# Altium schematic sheet LNA.SchDoc
size A4; SheetNumber: 9; SheetTotal: 18
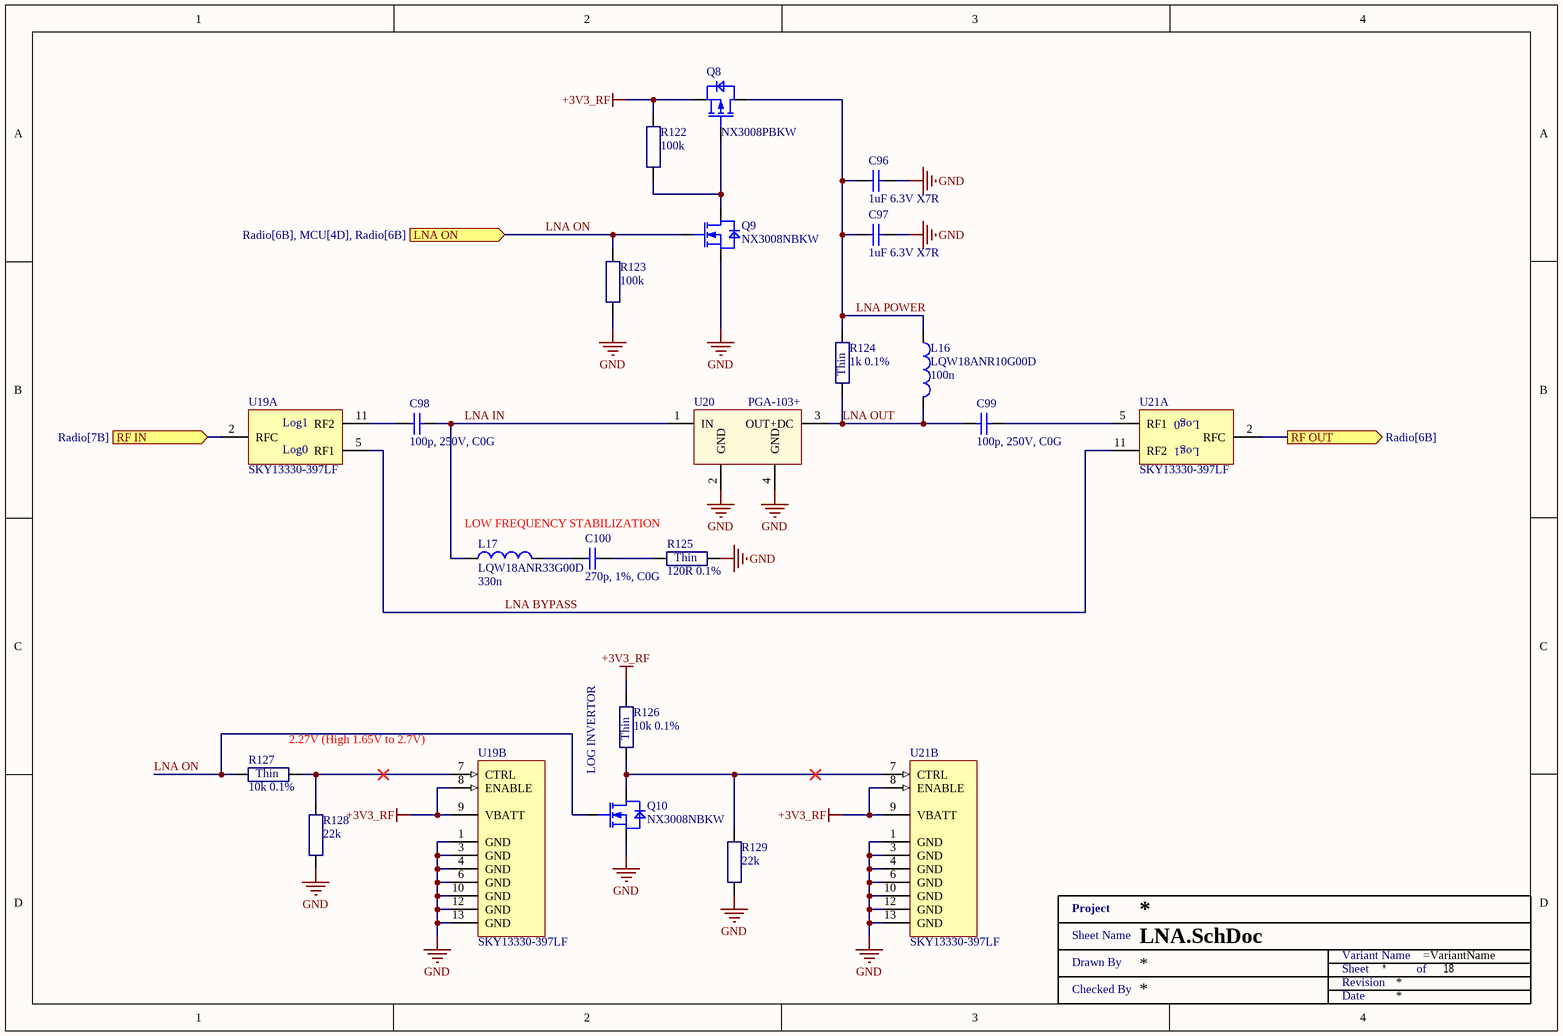
[diagram p0: LNA.SchDoc]

## Parts
C96  1uF 6.3V X7R  [SMD0402]
C97  1uF 6.3V X7R  [SMD0402]
C98  100p, 250V, C0G  [SMD0603]
C99  100p, 250V, C0G  [SMD0603]
C100  270p, 1%, C0G  [SMD0603]
L16  LQW18ANR10G00D  Inductance: 100n  [SMD0603 - L]
L17  LQW18ANR33G00D  Inductance: 330n  [SMD0603 - L]
Q8  NX3008PBKW  [SOT323]
Q9  NX3008NBKW  [SOT323]
Q10  NX3008NBKW  [SOT323]
R122  100k  [SMD0402 - R]
R123  100k  [SMD0402 - R]
R124  1k 0.1%  [SMD0402 - R]
R125  120R 0.1%  [SMD0402 - R]
R126  10k 0.1%  [SMD0402 - R]
R127  10k 0.1%  [SMD0402 - R]
R128  22k  [SMD0402 - R]
R129  22k  [SMD0402 - R]
U19  SKY13330-397LF  [QFN50P200X200X100_HS-13N]  (parts A,B of 2)
U20  PGA-103+  [SOT89]
U21  SKY13330-397LF  [QFN50P200X200X100_HS-13N]  (parts A,B of 2)
XX?  Title 1  (value not drawn)  (graphical)

## Ports
LNA ON (in, see Radio[6B], MCU[4D], Radio[6B]), RF IN (in, see Radio[7B]), RF OUT (out, see Radio[6B])

## Nets
+3V3_RF: Q8.2(S) R122.2 R126.2 U19.8(ENABLE) U19.9(VBATT) U21.8(ENABLE) U21.9(VBATT)
GND: C96.1 C97.1 Q9.2(S) Q10.2(S) R123.1 R125.2 R128.1 R129.1 U19.1(GND) U19.3(GND) U19.4(GND) U19.6(GND) U19.10(GND) U19.12(GND) U19.13(GND) U20.2(GND) U20.4(GND) U21.1(GND) U21.3(GND) U21.4(GND) U21.6(GND) U21.10(GND) U21.12(GND) U21.13(GND)
LNA BYPASS: U19.5(RF1) U21.11(RF2)
LNA IN: C98.2 L17.1 U20.1(IN)
LNA ON: Q9.1(G) Q10.1(G) R123.2 R127.1 ; port LNA ON
LNA OUT: C99.1 L16.2 R124.1 U20.3(OUT+DC)
LNA POWER: C96.2 C97.2 L16.1 Q8.3(D) R124.2
RF IN: U19.2(RFC) ; port RF IN
RF OUT: U21.2(RFC) ; port RF OUT
NetC98_1: C98.1 U19.11(RF2)
NetC99_2: C99.2 U21.5(RF1)
NetC100_1: C100.1 L17.2
NetC100_2: C100.2 R125.1
NetQ8_1: Q8.1(G) Q9.3(D) R122.1
NetQ10_3: Q10.3(D) R126.1 R129.2 U21.7(CTRL)
NetR127_2: R127.2 R128.2 U19.7(CTRL)

## Notes on the sheet
- LOW FREQUENCY STABILIZATION
- 2.27V (High 1.65V to 2.7V)
- LOG INVERTOR
- (in symbol RT0402BRE07120RL) Thin
- (in symbol SKY13330-397LF, part A) Log1; Log0
- (in symbol TC0225B1001TCC) Thin
- (in symbol TC0225B1002TCC) Thin
- (in symbol Title 1) Project; Sheet Name; Variant Name; Drawn By; Sheet; of; Revision; Checked By; Date

## Library data of the parts
C96 C97 = TCC0402X7R105K6R3AT: Capacitor: MLCC; SMD; 0402; 1µF; 6.3V; ±10%; X7R; CCTC; Capacitance: 1u; Supplier 1: LCSC; Supplier Part Number 1: C5448871; Manufacturer: CCTC; Manufacturer Part Number: TCC0402X7R105K6R3AT; Category: Ceramic Capacitors; Stock 1: 242350; Pricing 1: 50=0.0089, 500=0.0072, 1500=0.0063, 10000=0.0058, 20000=0.0053, 50000=0.005 (USD); ComponentLink1URL: https://datasheet.octopart.com:443/TCC0402X7R105K6R3AT-CCTC-datasheet-194166649.pdf?src-supplier=LCSC; ComponentLink1Description: https://datasheet.octopart.com:443/TCC0402X7R105K6R3AT-CCTC-datasheet-194166649.pdf?src-supplier=LCSC; ComponentLink2URL: https://datasheet.octopart.com:443/TCC0402X7R105K6R3AT-CCTC-datasheet-192317456.pdf?src-supplier=HQonline; ComponentLink2Description: https://datasheet.octopart.com:443/TCC0402X7R105K6R3AT-CCTC-datasheet-192317456.pdf?src-supplier=HQonline
C98 C99 = 885342006003: CAP CER 100PF 250V C0G/NP0 0603; Manufacturer: Wurth Electronics Inc.; Tolerance: ±5%; Temperature Coefficient: C0G, NP0; Notification: Current market demand for these product types have resulted in fluctuating and extending lead times. Lead times may differ.; Supplier 1: Digi-Key; Supplier Part Number 1: 732-12167-1-ND; Manufacturer Part Number: 885342006003; RoHS: RoHS Compliant; Category: Capacitors; Stock 1: 43; Pricing 1: 1=0.1, 10=0.043, 100=0.0385, 500=0.03406 (USD); Packaging: Cut Tape (CT); Part Status: Active; Voltage - Rated: 250V; Operating Temperature: -55°C ~ 125°C; Features: -; Ratings: -; Applications: General Purpose; Failure Rate: -; Mounting Type: Surface Mount, MLCC; Package / Case: 0603 (1608 Metric); Size / Dimension: 0.063" L x 0.031" W (1.60mm x 0.80mm); Height - Seated (Max): -; Thickness (Max): 0.034" (0.87mm); Lead Spacing: -; Lead Style: -; ComponentLink1URL: https://katalog.we-online.de/pbs/datasheet/885342006003.pdf; ComponentLink1Description: https://katalog.we-online.de/pbs/datasheet/885342006003.pdf; Supplier 2: Farnell; Supplier Part Number 2: 2812519; Supplier 3: Mouser; Supplier Part Number 3: 710-885342006003; Capacitance: 100p
C100 = GCM1885C2A271FA16D: Cap Ceramic 270pF 100V C0G 1% Pad SMD 0603 125C Automotive T/R; Manufacturer: Murata; Supplier 1: Mouser; Supplier Part Number 1: 81-GCM1885C2A271FA6D; Manufacturer Part Number: GCM1885C2A271FA16D; RoHS: Yes; Category: Ceramic Capacitors; Stock 1: 7715; Pricing 1: 1=0.23000, 10=0.09600, 50=0.09600, 100=0.08100, 1000=0.04900, 10000=0.03800 (USD); Mount: Surface Mount; Case/Package: 0603; Case Code (Imperial): 0603; Case Code (Metric): 1608; Min Operating Temperature: -55°C; Max Operating Temperature: 125°C; Packaging: Cut Tape; Capacitance: 270p; Tolerance: 1%; Voltage Rating: 100V; Ratings: AEC-Q200; RoHS Compliant: Yes; ComponentLink1URL: http://search.murata.co.jp/Ceramy/image/img/A01X/G101/ENG/GCM1885C2A271FA16-01.pdf?src-supplier=Digi-Key; ComponentLink1Description: http://search.murata.co.jp/Ceramy/image/img/A01X/G101/ENG/GCM1885C2A271FA16-01.pdf?src-supplier=Digi-Key; Supplier 2: Farnell; Supplier Part Number 2: 3581578; Supplier 3: Digi-Key; Supplier Part Number 3: 490-16410-1-ND
L16 = LQW18ANR10G00D: Inductor RF Chip Wirewound 100nH 2% 100MHz 34Q-Factor 220mA 680mOhm DCR 0603 Paper T/R; Manufacturer: Murata; Manufacturer Lifecycle Status: IN PRODUCTION; Core Material: Air; Current: 140mA; DC Resistance (DCR): 680mΩ; Number of Circuits: 1; Q Factor: 34; Self Resonant Frequency: 1.8GHz; Shielding: Unshielded; Test Frequency: 150MHz; Supplier 1: Mouser; Supplier Part Number 1: 81-LQW18ANR10G00D; Manufacturer Part Number: LQW18ANR10G00D; RoHS: Compliant; Category: Fixed Inductors; Stock 1: 745; Pricing 1: 1=0.12, 10=0.099, 50=0.099, 100=0.081, 1000=0.067, 10000=0.05 (USD); Case/Package: 0603; Case Code (Imperial): 0603; Case Code (Metric): 1608; Composition: Wirewound; Current Rating: 220mA; DC Current: 220mA; Depth: 1mm; Frequency: 100MHz; Height: 800µm; Height - Seated (Max): 990.6µm; Inductance Tolerance: 2%; Lead Free: Lead Free; Length: 1.6mm; Lifecycle Status: Production; Max Current Rating: 220mA; Max DC Current: 220mA; Max Operating Temperature: 125°C; Military Standard: Not; Min Operating Temperature: -55°C; Mounting Technology: Surface Mount; Pins: 2; Number of Terminals: 2; Packaging: Cut Tape; Radiation Hardening: No; REACH SVHC: Yes; RMS Current (Irms): 220mA; Schedule B: 8504500000, 8504500000|8504500000, 8504500000|8504500000|8504500000, 8504500000|8504500000|8504500000|8504500000; ESR: 680mΩ; Termination: SMD/SMT; Tolerance: 2%; Weight: 3.005049mg; Width: 800µm; ComponentLink1URL: https://datasheet.octopart.com:443/LQW18ANR10G00D-Murata-datasheet-11553032.pdf?src-supplier=element14+APAC; ComponentLink1Description: https://datasheet.octopart.com:443/LQW18ANR10G00D-Murata-datasheet-11553032.pdf?src-supplier=element14+APAC; ComponentLink2URL: https://datasheet.octopart.com:443/LQW18ANR10G00D-Murata-datasheet-518094.pdf?src-supplier=element14+APAC; ComponentLink2Description: https://datasheet.octopart.com:443/LQW18ANR10G00D-Murata-datasheet-518094.pdf?src-supplier=element14+APAC; ComponentLink3URL: https://datasheet.octopart.com:443/LQW18ANR10G00D-Murata-datasheet-14392343.pdf?src-supplier=Future+Electronics; ComponentLink3Description: https://datasheet.octopart.com:443/LQW18ANR10G00D-Murata-datasheet-14392343.pdf?src-supplier=Future+Electronics; ComponentLink4URL: https://datasheet.octopart.com:443/LQW18ANR10G00D-Murata-datasheet-78381811.pdf?src-supplier=Future+Electronics; ComponentLink4Description: https://datasheet.octopart.com:443/LQW18ANR10G00D-Murata-datasheet-78381811.pdf?src-supplier=Future+Electronics; ComponentLink5URL: https://datasheet.octopart.com:443/LQW18ANR10G00D-Murata-datasheet-44110440.pdf?src-supplier=Future+Electronics; ComponentLink5Description: https://datasheet.octopart.com:443/LQW18ANR10G00D-Murata-datasheet-44110440.pdf?src-supplier=Future+Electronics; ComponentLink6URL: https://datasheet.octopart.com:443/LQW18ANR10G00D-Murata-datasheet-145452279.pdf?src-supplier=Geoflip; ComponentLink6Description: https://datasheet.octopart.com:443/LQW18ANR10G00D-Murata-datasheet-145452279.pdf?src-supplier=Geoflip; ComponentLink7URL: https://datasheet.octopart.com:443/LQW18ANR10G00D-Murata-datasheet-141294535.pdf?src-supplier=Ciiva; ComponentLink7Description: https://datasheet.octopart.com:443/LQW18ANR10G00D-Murata-datasheet-141294535.pdf?src-supplier=Ciiva; ComponentLink8URL: https://datasheet.octopart.com:443/LQW18ANR10G00D-Murata-datasheet-140718114.pdf?src-supplier=Ciiva; ComponentLink8Description: https://datasheet.octopart.com:443/LQW18ANR10G00D-Murata-datasheet-140718114.pdf?src-supplier=Ciiva; ComponentLink9URL: https://datasheet.octopart.com:443/LQW18ANR10G00D-Murata-datasheet-138759140.pdf?src-supplier=Ciiva; ComponentLink9Description: https://datasheet.octopart.com:443/LQW18ANR10G00D-Murata-datasheet-138759140.pdf?src-supplier=Ciiva; ComponentLink10URL: https://datasheet.octopart.com:443/LQW18ANR10G00D-Murata-datasheet-150009461.pdf?src-supplier=Arrow.cn; ComponentLink10Description: https://datasheet.octopart.com:443/LQW18ANR10G00D-Murata-datasheet-150009461.pdf?src-supplier=Arrow.cn; ComponentLink11URL: https://datasheet.octopart.com:443/LQW18ANR10G00D-Murata-datasheet-140569729.pdf?src-supplier=Arrow.cn; ComponentLink11Description: https://datasheet.octopart.com:443/LQW18ANR10G00D-Murata-datasheet-140569729.pdf?src-supplier=Arrow.cn; ComponentLink12URL: https://datasheet.octopart.com:443/LQW18ANR10G00D-Murata-datasheet-67271409.pdf?src-supplier=TME; ComponentLink12Description: https://datasheet.octopart.com:443/LQW18ANR10G00D-Murata-datasheet-67271409.pdf?src-supplier=TME; ComponentLink13URL: https://datasheet.octopart.com:443/LQW18ANR10G00D-Murata-datasheet-117639981.pdf?src-supplier=TME; ComponentLink13Description: https://datasheet.octopart.com:443/LQW18ANR10G00D-Murata-datasheet-117639981.pdf?src-supplier=TME; ComponentLink14URL: https://datasheet.octopart.com:443/LQW18ANR10G00D-Murata-datasheet-14066793.pdf?src-supplier=iiiC; ComponentLink14Description: https://datasheet.octopart.com:443/LQW18ANR10G00D-Murata-datasheet-14066793.pdf?src-supplier=iiiC; ComponentLink15URL: http://sigma.octopart.com:80/reach_statement/Murata-company-16.pdf?src-supplier=Compliance+Statements; ComponentLink15Description: http://sigma.octopart.com:80/reach_statement/Murata-company-16.pdf?src-supplier=Compliance+Statements; Supplier Part Number 2: C98088; Supplier 2: LCSC
L17 = LQW18ANR33G00D: Inductor RF Chip Wirewound 330nH 2% 100MHz 30Q-Factor 85mA 5.5Ohm DCR 0603 Paper T/R; Manufacturer: Murata; Manufacturer Lifecycle Status: IN PRODUCTION; Core Material: Air; DC Resistance (DCR): 5.5Ω; Number of Circuits: 1; Q Factor: 30; Self Resonant Frequency: 800MHz; Shielding: Unshielded; Supplier 1: Mouser; Supplier Part Number 1: 81-LQW18ANR33G00D; Manufacturer Part Number: LQW18ANR33G00D; RoHS: Compliant; Category: Fixed Inductors; Stock 1: 17073; Pricing 1: 1=0.12, 10=0.101, 50=0.101, 100=0.084, 1000=0.069, 10000=0.054 (USD); Case/Package: 0603; Case Code (Imperial): 0603; Case Code (Metric): 1608; Composition: Wirewound; Country of Origin: Japan; Current Rating: 85mA; DC Current: 85mA; Depth: 1mm; Export Control Classification Number (ECCN) Code: EAR99; Height: 800µm; Harmonized Tariff Schedule (HTS) Code: 8504.50.80.00; Inductance Tolerance: 2%; Introduction Date: 2002-03-28; Length: 1.6mm; Lifecycle Status: Production; Max Current Rating: 85mA; Max DC Current: 85mA; Max Operating Temperature: 125°C; Military Standard: Not; Min Operating Temperature: -55°C; Mounting Technology: Surface Mount; Number of Terminals: 2; Radiation Hardening: No; REACH SVHC: Yes; RMS Current (Irms): 85mA; Schedule B: 8504500000, 8504500000|8504500000, 8504500000|8504500000|8504500000, 8504500000|8504500000|8504500000|8504500000; ESR: 5.5Ω; Termination: SMD/SMT; Test Frequency: 100MHz; Tolerance: 2%; Weight: 3.005049mg; Width: 800µm; ComponentLink1URL: https://datasheet.octopart.com:443/LQW18ANR33G00D-Murata-datasheet-182017727.pdf?src-supplier=Farnell; ComponentLink1Description: https://datasheet.octopart.com:443/LQW18ANR33G00D-Murata-datasheet-182017727.pdf?src-supplier=Farnell; ComponentLink2URL: https://datasheet.octopart.com:443/LQW18ANR33G00D-Murata-datasheet-37686850.pdf?src-supplier=Farnell; ComponentLink2Description: https://datasheet.octopart.com:443/LQW18ANR33G00D-Murata-datasheet-37686850.pdf?src-supplier=Farnell; ComponentLink3URL: https://datasheet.octopart.com:443/LQW18ANR33G00D-Murata-datasheet-179128095.pdf?src-supplier=Arrow.cn; ComponentLink3Description: https://datasheet.octopart.com:443/LQW18ANR33G00D-Murata-datasheet-179128095.pdf?src-supplier=Arrow.cn; ComponentLink4URL: https://datasheet.octopart.com:443/LQW18ANR33G00D-Murata-datasheet-142046249.pdf?src-supplier=Arrow.cn; ComponentLink4Description: https://datasheet.octopart.com:443/LQW18ANR33G00D-Murata-datasheet-142046249.pdf?src-supplier=Arrow.cn; ComponentLink5URL: https://datasheet.octopart.com:443/LQW18ANR33G00D-Murata-datasheet-145452279.pdf?src-supplier=Geoflip; ComponentLink5Description: https://datasheet.octopart.com:443/LQW18ANR33G00D-Murata-datasheet-145452279.pdf?src-supplier=Geoflip; ComponentLink6URL: https://datasheet.octopart.com:443/LQW18ANR33G00D-Murata-datasheet-141294535.pdf?src-supplier=Ciiva; ComponentLink6Description: https://datasheet.octopart.com:443/LQW18ANR33G00D-Murata-datasheet-141294535.pdf?src-supplier=Ciiva; ComponentLink7URL: https://datasheet.octopart.com:443/LQW18ANR33G00D-Murata-datasheet-140718199.pdf?src-supplier=Ciiva; ComponentLink7Description: https://datasheet.octopart.com:443/LQW18ANR33G00D-Murata-datasheet-140718199.pdf?src-supplier=Ciiva; ComponentLink8URL: https://datasheet.octopart.com:443/LQW18ANR33G00D-Murata-datasheet-138759224.pdf?src-supplier=Ciiva; ComponentLink8Description: https://datasheet.octopart.com:443/LQW18ANR33G00D-Murata-datasheet-138759224.pdf?src-supplier=Ciiva; ComponentLink9URL: https://datasheet.octopart.com:443/LQW18ANR33G00D-Murata-datasheet-11553032.pdf?src-supplier=_legacy+Avnet; ComponentLink9Description: https://datasheet.octopart.com:443/LQW18ANR33G00D-Murata-datasheet-11553032.pdf?src-supplier=_legacy+Avnet; ComponentLink10URL: https://datasheet.octopart.com:443/LQW18ANR33G00D-Murata-datasheet-518094.pdf?src-supplier=_legacy+Avnet; ComponentLink10Description: https://datasheet.octopart.com:443/LQW18ANR33G00D-Murata-datasheet-518094.pdf?src-supplier=_legacy+Avnet; ComponentLink11URL: https://datasheet.octopart.com:443/LQW18ANR33G00D-Murata-datasheet-14066793.pdf?src-supplier=iiiC; ComponentLink11Description: https://datasheet.octopart.com:443/LQW18ANR33G00D-Murata-datasheet-14066793.pdf?src-supplier=iiiC; ComponentLink12URL: https://datasheet.octopart.com/LQW18ANR33G00D-Murata-datasheet-14392347.pdf; ComponentLink12Description: https://datasheet.octopart.com/LQW18ANR33G00D-Murata-datasheet-14392347.pdf; ComponentLink13URL: http://sigma.octopart.com:80/reach_statement/Murata-company-16.pdf?src-supplier=Compliance+Statements; ComponentLink13Description: http://sigma.octopart.com:80/reach_statement/Murata-company-16.pdf?src-supplier=Compliance+Statements; Supplier Part Number 2: C162651; Supplier 2: LCSC
Q8 = NX3008PBKW: NXP - NX3008PBKW - MOSFET, P CH, 30V, 200MA, SOT323; Transistor Polarity: P Channel; Continuous Drain Current Id: -200; Drain Source Voltage Vds: -30; On Resistance Rds(on): 2.8; Rds(on) Test Voltage Vgs: -4.5; Threshold Voltage Vgs: -900; Power Dissipation Pd: 260; Transistor Case Style: SOT-323; No. of Pins: 3; SVHC: No SVHC (17-Dec-2015); Pulse Current Idm: -0.8; Voltage Vgs th Max: 8V<!--FANDB--><div class="features-and-benefits-container"><div class="features-and-benefits-description"><span class="features-benefits-value">The NX3008PBKW is a P-channel enhancement mode Field-Effect Transistor (FET) in surface mount plastic package using Trench MOSFET technology. Suitable for relay driver, high-speed line driver and high-side loadswitch.</span></div><div class="features-and-benefits-list"><ul class="features-and-benefits-list-list"><li class="features-and-benefits-list-item">Logic-level compatible</li><li class="features-and-benefits-list-item">Very fast switching</li><li class="features-and-benefits-list-item">AEC-Q101 Qualified</li><li class="features-and-benefits-list-item">Up to 1; Supplier 1: Farnell; Supplier Part Number 1: 2069551; Manufacturer: NXP; Manufacturer Part Number: NX3008PBKW; RoHS: YES; Stock 1: 18626; Pricing 1: 1=0.037, 25=0.0347, 100=0.0323, 250=0.03, 500=0.0294, 2000=0.0288, 4000=0.0282, 20000=0.0276 (GBP); Operating Temperature Max: 150; Product Range: -; Automotive Qualification Standard: -; MSL: MSL 1 - Unlimited; Operating Temperature Min: -55; Operating Temperature Range: -55°C to +150; ComponentLink1URL: http://www.farnell.com/datasheets/1508398.pdf; ComponentLink1Description: http://www.farnell.com/datasheets/1508398.pdf; Supplier 2: Digi-Key; Supplier Part Number 2: 568-10503-1-ND
Q9 Q10 = NX3008NBKW: NXP - NX3008NBKW - MOSFET, N CH, 30V, 350MA, SOT323; Transistor Polarity: N Channel; Continuous Drain Current Id: 350; Drain Source Voltage Vds: 30; On Resistance Rds(on): 1; Rds(on) Test Voltage Vgs: 4.5; Threshold Voltage Vgs: 900; Power Dissipation Pd: 260; Transistor Case Style: SOT-323; No. of Pins: 3; SVHC: No SVHC (17-Dec-2015); Pulse Current Idm: -0.8; Voltage Vgs th Max: 8; Manufacturer: NXP; Manufacturer Part Number: NX3008NBKW; RoHS: YES; Stock 1: 4764; Pricing 1: 1=0.0425, 25=0.0385, 100=0.0347, 250=0.0334, 500=0.0312, 2000=0.0291, 4000=0.0282, 20000=0.0273 (GBP); Operating Temperature Max: 150; Product Range: -; Automotive Qualification Standard: -; MSL: MSL 1 - Unlimited; Operating Temperature Min: -55; Operating Temperature Range: -55°C to +150; ComponentLink1URL: http://www.farnell.com/datasheets/1508392.pdf; ComponentLink1Description: http://www.farnell.com/datasheets/1508392.pdf; Supplier 1: Mouser; Supplier Part Number 1: 771-NX3008NBKW,115; Supplier 2: Farnell; Supplier Part Number 2: 2069546; Supplier 3: Arrow; Supplier Part Number 3: NX3008NBKW,115
R122 R123 = RC0402FR-07100KL: 62.5mW Thick Film Resistors 50V ±100ppm/℃ ±1% 100kΩ 0402 Chip Resistor - Surface Mount ROHS; Manufacturer: Yageo Group; Max Power Dissipation: 63mW; Temperature Coefficient: 100ppm/°C; Supplier: Mouser; Supplier Part Number: 603-RC0402FR-07100KL; Manufacturer Part Number: RC0402FR-07100KL; RoHS: Compliant; Category: Chip SMD Resistors; Stock: 3390880; Pricing: 1=0,1, 10=0,011, 50=0,011, 100=0,007, 1000=0,006, 10000=0,002 (USD); Case/Package: 0402; Case Code (Imperial): 0402; Case Code (Metric): 0402; China RoHS: Non-Compliant; Composition: Thick Film; Contact Plating: Tin; Depth: 500µm; Features: Moisture Resistant; Height: 350µm; Lead Free: Lead Free; Length: 1mm; Lifecycle Status: Production; Max Operating Temperature: 155°C; Military Standard: Not; Min Operating Temperature: -55°C; Mounting Technology: Surface Mount; Pins: 2; Number of Terminals: 2; Number of Terminations: 2; Packaging: Cut Tape (CT); Power Rating: 62.5mW; Radiation Hardening: No; REACH SVHC: Yes; Resistance: 100k; Schedule B: 8533210045, 8533210045|8533210045, 8533210045|8533210045|8533210045, 8533210045|8533210045|8533210045|8533210045; Termination: SMD/SMT; Tolerance: 1%; Voltage Rating: 50V; Voltage Rating (AC): 50V; Voltage Rating (DC): 50V; Width: 500µm; Working Voltage: 50V; ComponentLink1URL: https://datasheet.octopart.com:443/RC0402FR-07100KL-Yageo-datasheet-175887523.pdf?src-supplier=Newark; ComponentLink1Description: https://datasheet.octopart.com:443/RC0402FR-07100KL-Yageo-datasheet-175887523.pdf?src-supplier=Newark; ComponentLink2URL: https://datasheet.octopart.com:443/RC0402FR-07100KL-Yageo-datasheet-10408619.pdf?src-supplier=Newark; ComponentLink2Description: https://datasheet.octopart.com:443/RC0402FR-07100KL-Yageo-datasheet-10408619.pdf?src-supplier=Newark; ComponentLink3URL: https://datasheet.octopart.com:443/RC0402FR-07100KL-Yageo-datasheet-8324527.pdf?src-supplier=Newark; ComponentLink3Description: https://datasheet.octopart.com:443/RC0402FR-07100KL-Yageo-datasheet-8324527.pdf?src-supplier=Newark; ComponentLink4URL: https://datasheet.octopart.com:443/RC0402FR-07100KL-Yageo-datasheet-103092701.pdf?src-supplier=Upverter; ComponentLink4Description: https://datasheet.octopart.com:443/RC0402FR-07100KL-Yageo-datasheet-103092701.pdf?src-supplier=Upverter; ComponentLink5URL: https://datasheet.octopart.com:443/RC0402FR-07100KL-Yageo-datasheet-141435361.pdf?src-supplier=Upverter; ComponentLink5Description: https://datasheet.octopart.com:443/RC0402FR-07100KL-Yageo-datasheet-141435361.pdf?src-supplier=Upverter; ComponentLink6URL: https://datasheet.octopart.com:443/RC0402FR-07100KL-Yageo-datasheet-62067350.pdf?src-supplier=Farnell; ComponentLink6Description: https://datasheet.octopart.com:443/RC0402FR-07100KL-Yageo-datasheet-62067350.pdf?src-supplier=Farnell; ComponentLink7URL: https://datasheet.octopart.com:443/RC0402FR-07100KL-Yageo-datasheet-12531192.pdf?src-supplier=Future+Electronics; ComponentLink7Description: https://datasheet.octopart.com:443/RC0402FR-07100KL-Yageo-datasheet-12531192.pdf?src-supplier=Future+Electronics; ComponentLink8URL: https://datasheet.octopart.com:443/RC0402FR-07100KL-Yageo-Group-datasheet-176638170.pdf?src-supplier=Future+Electronics; ComponentLink8Description: https://datasheet.octopart.com:443/RC0402FR-07100KL-Yageo-Group-datasheet-176638170.pdf?src-supplier=Future+Electronics; ComponentLink9URL: https://datasheet.octopart.com:443/RC0402FR-07100KL-Yageo-datasheet-164759695.pdf?src-supplier=Future+Electronics; ComponentLink9Description: https://datasheet.octopart.com:443/RC0402FR-07100KL-Yageo-datasheet-164759695.pdf?src-supplier=Future+Electronics; ComponentLink10URL: https://datasheet.octopart.com:443/RC0402FR-07100KL-Yageo-datasheet-127823281.pdf?src-supplier=Future+Electronics; ComponentLink10Description: https://datasheet.octopart.com:443/RC0402FR-07100KL-Yageo-datasheet-127823281.pdf?src-supplier=Future+Electronics; ComponentLink11URL: https://datasheet.octopart.com:443/RC0402FR-07100KL-Yageo-datasheet-137700087.pdf?src-supplier=Future+Electronics; ComponentLink11Description: https://datasheet.octopart.com:443/RC0402FR-07100KL-Yageo-datasheet-137700087.pdf?src-supplier=Future+Electronics; ComponentLink12URL: https://datasheet.octopart.com:443/RC0402FR-07100KL-Yageo-datasheet-98239111.pdf?src-supplier=Future+Electronics; ComponentLink12Description: https://datasheet.octopart.com:443/RC0402FR-07100KL-Yageo-datasheet-98239111.pdf?src-supplier=Future+Electronics; ComponentLink13URL: https://datasheet.octopart.com:443/RC0402FR-07100KL-Yageo-datasheet-77992522.pdf?src-supplier=Future+Electronics; ComponentLink13Description: https://datasheet.octopart.com:443/RC0402FR-07100KL-Yageo-datasheet-77992522.pdf?src-supplier=Future+Electronics; ComponentLink14URL: https://datasheet.octopart.com:443/RC0402FR-07100KL-Yageo-datasheet-67302840.pdf?src-supplier=Future+Electronics; ComponentLink14Description: https://datasheet.octopart.com:443/RC0402FR-07100KL-Yageo-datasheet-67302840.pdf?src-supplier=Future+Electronics; ComponentLink15URL: https://datasheet.octopart.com:443/RC0402FR-07100KL-Yageo-datasheet-8324255.pdf?src-supplier=Future+Electronics; ComponentLink15Description: https://datasheet.octopart.com:443/RC0402FR-07100KL-Yageo-datasheet-8324255.pdf?src-supplier=Future+Electronics; ComponentLink16URL: https://datasheet.octopart.com:443/RC0402FR-07100KL-Yageo-datasheet-8329306.pdf?src-supplier=element14; ComponentLink16Description: https://datasheet.octopart.com:443/RC0402FR-07100KL-Yageo-datasheet-8329306.pdf?src-supplier=element14; ComponentLink17URL: https://datasheet.octopart.com:443/RC0402FR-07100KL-Yageo-datasheet-175423674.pdf?src-supplier=SOS+electronic; ComponentLink17Description: https://datasheet.octopart.com:443/RC0402FR-07100KL-Yageo-datasheet-175423674.pdf?src-supplier=SOS+electronic; ComponentLink18URL: https://datasheet.octopart.com:443/RC0402FR-07100KL-Yageo-datasheet-148775077.pdf?src-supplier=TME; ComponentLink18Description: https://datasheet.octopart.com:443/RC0402FR-07100KL-Yageo-datasheet-148775077.pdf?src-supplier=TME; ComponentLink19URL: https://datasheet.octopart.com:443/RC0402FR-07100KL-Yageo-datasheet-79472498.pdf?src-supplier=Megastar; ComponentLink19Description: https://datasheet.octopart.com:443/RC0402FR-07100KL-Yageo-datasheet-79472498.pdf?src-supplier=Megastar; ComponentLink20URL: https://datasheet.octopart.com/RC0402FR-07100KL-Yageo-datasheet-73766026.pdf; ComponentLink20Description: https://datasheet.octopart.com/RC0402FR-07100KL-Yageo-datasheet-73766026.pdf; ComponentLink21URL: http://sigma.octopart.com:80/conflict_mineral_statement/Yageo-company-3.pdf?src-supplier=Compliance+Statements; ComponentLink21Description: http://sigma.octopart.com:80/conflict_mineral_statement/Yageo-company-3.pdf?src-supplier=Compliance+Statements; ComponentLink22URL: http://sigma.octopart.com:80/rohs_statement/Yageo-company-2.pdf?src-supplier=Compliance+Statements; ComponentLink22Description: http://sigma.octopart.com:80/rohs_statement/Yageo-company-2.pdf?src-supplier=Compliance+Statements
R124 = TC0225B1001TCC: 62.5mW Thin Film Resistor 25V ±25ppm/℃ ±0.1% 1kΩ 0402 Chip Resistor - Surface Mount ROHS; Manufacturer: Uniroyal; Working Voltage: 50V; Supplier 1: LCSC; Supplier Part Number 1: C2989674; Manufacturer Part Number: TC0225B1001TCC; Category: Chip SMD Resistors; Stock 1: 12060; Pricing 1: 20=0.036, 200=0.031, 600=0.0283, 2000=0.0267, 10000=0.0252, 20000=0.0245 (USD); Case/Package: 0402; Composition: Thin Film; Export Control Classification Number (ECCN) Code: EAR99; Height: 300µm; Harmonized Tariff Schedule (HTS) Code: 8533.21.00.30; Length: 1mm; Lifecycle Status: Production; Max Operating Temperature: 155°C; Min Operating Temperature: -55°C; Mounting Technology: Surface Mount; Number of Terminals: 2; Power Rating: 62.5mW; Resistance: 1k; Tolerance: 0.1%; Width: 500µm; ComponentLink1URL: https://datasheet.octopart.com:443/TC0225B1001TCC-Uniroyal-datasheet-194228365.pdf?src-supplier=LCSC; ComponentLink1Description: https://datasheet.octopart.com:443/TC0225B1001TCC-Uniroyal-datasheet-194228365.pdf?src-supplier=LCSC
R125 = RT0402BRE07120RL: 63mW Thin Film Resistor ±50ppm/℃ ±0.1% 120Ω 0402 Chip Resistor - Surface Mount ROHS; Manufacturer: Yageo Group; Power Rating: 62.5mW; Temperature Coefficient: 50ppm/°C; Voltage Rating: 50V; Supplier: Mouser; Supplier Part Number: 603-RT0402BRE07120RL; Manufacturer Part Number: RT0402BRE07120RL; RoHS: Compliant; Category: Chip SMD Resistors; Pricing: 1=0,4, 10=0,205, 50=0,205, 100=0,121, 1000=0,079, 10000=0,052 (USD); Case/Package: 0402; Case Code (Metric): 0402; China RoHS: Non-Compliant; Composition: Thin Film; Height: 300µm; Lead Free: Lead Free; Length: 1mm; Lifecycle Status: Production; Max Operating Temperature: 155°C; Max Power Dissipation: 63mW; Min Operating Temperature: -55°C; Mounting Technology: Surface Mount; Number of Terminals: 2; Number of Terminations: 2; Packaging: Tape & Reel (TR); REACH SVHC: Yes; Resistance: 120R; Tolerance: 0.1%; Voltage Rating (DC): 50V; Width: 500µm; Working Voltage: 50V; ComponentLink1URL: https://datasheet.octopart.com:443/RT0402BRE07120RL-Yageo-datasheet-176402239.pdf?src-supplier=IHS; ComponentLink1Description: https://datasheet.octopart.com:443/RT0402BRE07120RL-Yageo-datasheet-176402239.pdf?src-supplier=IHS; ComponentLink2URL: https://datasheet.octopart.com:443/RT0402BRE07120RL-Yageo-datasheet-96443642.pdf?src-supplier=Upverter; ComponentLink2Description: https://datasheet.octopart.com:443/RT0402BRE07120RL-Yageo-datasheet-96443642.pdf?src-supplier=Upverter; ComponentLink3URL: https://datasheet.octopart.com:443/RT0402BRE07120RL-Yageo-Group-datasheet-141265893.pdf?src-supplier=ODG+(Origin+Data+Global); ComponentLink3Description: https://datasheet.octopart.com:443/RT0402BRE07120RL-Yageo-Group-datasheet-141265893.pdf?src-supplier=ODG+(Origin+Data+Global); ComponentLink4URL: https://datasheet.octopart.com/RT0402BRE07120RL-Yageo-datasheet-86813807.pdf; ComponentLink4Description: https://datasheet.octopart.com/RT0402BRE07120RL-Yageo-datasheet-86813807.pdf; ComponentLink5URL: http://sigma.octopart.com:80/conflict_mineral_statement/Yageo-company-3.pdf?src-supplier=Compliance+Statements; ComponentLink5Description: http://sigma.octopart.com:80/conflict_mineral_statement/Yageo-company-3.pdf?src-supplier=Compliance+Statements; ComponentLink6URL: http://sigma.octopart.com:80/rohs_statement/Yageo-company-2.pdf?src-supplier=Compliance+Statements; ComponentLink6Description: http://sigma.octopart.com:80/rohs_statement/Yageo-company-2.pdf?src-supplier=Compliance+Statements; Supplier 1: Mouser; Supplier Part Number 1: 603-RT0402BRE07120RL; Supplier 2: LCSC; Supplier Part Number 2: C853003
R126 R127 = TC0225B1002TCC: Fixed Resistor, Thin Film, 0.0625W, 10000ohm, 50V, 0.1% +/-Tol, Surface Mount, 0402; Manufacturer: Uniroyal; Power Rating: 62.5mW; Supplier 1: LCSC; Supplier Part Number 1: C2989267; Manufacturer Part Number: TC0225B1002TCC; Category: Chip SMD Resistors; Stock 1: 10200; Pricing 1: 20=0.0396, 200=0.0352, 600=0.0327, 2000=0.0312, 10000=0.0299, 20000=0.0292 (USD); Case/Package: 0402; Composition: Thin Film; Export Control Classification Number (ECCN) Code: EAR99; Height: 300µm; Harmonized Tariff Schedule (HTS) Code: 8533.21.00.30; Length: 1mm; Lifecycle Status: Production; Max Operating Temperature: 155°C; Min Operating Temperature: -55°C; Mounting Technology: Surface Mount; Number of Terminals: 2; Resistance: 10k; Tolerance: 0.1%; Width: 500µm; Working Voltage: 50V; ComponentLink1URL: https://datasheet.octopart.com:443/TC0225B1002TCC-Uniroyal-datasheet-194228365.pdf?src-supplier=LCSC; ComponentLink1Description: https://datasheet.octopart.com:443/TC0225B1002TCC-Uniroyal-datasheet-194228365.pdf?src-supplier=LCSC
R128 R129 = RC0402FR-0722KL: Res Thick Film 0402 22K Ohm 1% 0.063W(1/16W) ±100ppm/C Pad SMD T/R; Manufacturer: Yageo Group; Max Power Dissipation: 63mW; Power Rating: 62.5mW; Temperature Coefficient: 100ppm/°C; Voltage Rating: 50V; Supplier 1: Mouser; Supplier Part Number 1: 603-RC0402FR-0722KL; Manufacturer Part Number: RC0402FR-0722KL; RoHS: Compliant; Category: Chip SMD Resistors; Stock 1: 473074; Pricing 1: 1=0.1, 10=0.009, 50=0.009, 100=0.007, 1000=0.006, 10000=0.002 (USD); Case/Package: 0402; Case Code (Imperial): 0402; China RoHS: Non-Compliant; Composition: Thick Film; Depth: 500µm; Features: Moisture Resistant; Height: 350µm; Lead Free: Lead Free; Length: 1mm; Lifecycle Status: Production; Max Operating Temperature: 155°C; Military Standard: Not; Min Operating Temperature: -55°C; Mounting Technology: Surface Mount; Pins: 2; Number of Terminals: 2; Number of Terminations: 2; Packaging: Tape & Reel; REACH SVHC: Yes; Resistance: 22k; Schedule B: 8533210045, 8533210045|8533210045, 8533210045|8533210045|8533210045, 8533210045|8533210045|8533210045|8533210045; Termination: SMD/SMT; Tolerance: 1%; Voltage Rating (AC): 50V; Voltage Rating (DC): 50V; Width: 500µm; Working Voltage: 50V; ComponentLink1URL: https://datasheet.octopart.com:443/RC0402FR-0722KL-Yageo-datasheet-175887523.pdf?src-supplier=IHS; ComponentLink1Description: https://datasheet.octopart.com:443/RC0402FR-0722KL-Yageo-datasheet-175887523.pdf?src-supplier=IHS; ComponentLink2URL: https://datasheet.octopart.com:443/RC0402FR-0722KL-Yageo-datasheet-10408619.pdf?src-supplier=element14+APAC; ComponentLink2Description: https://datasheet.octopart.com:443/RC0402FR-0722KL-Yageo-datasheet-10408619.pdf?src-supplier=element14+APAC; ComponentLink3URL: https://datasheet.octopart.com:443/RC0402FR-0722KL-Yageo-datasheet-62067350.pdf?src-supplier=element14+APAC; ComponentLink3Description: https://datasheet.octopart.com:443/RC0402FR-0722KL-Yageo-datasheet-62067350.pdf?src-supplier=element14+APAC; ComponentLink4URL: https://datasheet.octopart.com:443/RC0402FR-0722KL-Yageo-datasheet-103092701.pdf?src-supplier=Upverter; ComponentLink4Description: https://datasheet.octopart.com:443/RC0402FR-0722KL-Yageo-datasheet-103092701.pdf?src-supplier=Upverter; ComponentLink5URL: https://datasheet.octopart.com:443/RC0402FR-0722KL-Yageo-Group-datasheet-190305687.pdf?src-supplier=Future+Electronics; ComponentLink5Description: https://datasheet.octopart.com:443/RC0402FR-0722KL-Yageo-Group-datasheet-190305687.pdf?src-supplier=Future+Electronics; ComponentLink6URL: https://datasheet.octopart.com:443/RC0402FR-0722KL-Yageo-datasheet-164759695.pdf?src-supplier=Future+Electronics; ComponentLink6Description: https://datasheet.octopart.com:443/RC0402FR-0722KL-Yageo-datasheet-164759695.pdf?src-supplier=Future+Electronics; ComponentLink7URL: https://datasheet.octopart.com:443/RC0402FR-0722KL-Yageo-datasheet-137700087.pdf?src-supplier=Future+Electronics; ComponentLink7Description: https://datasheet.octopart.com:443/RC0402FR-0722KL-Yageo-datasheet-137700087.pdf?src-supplier=Future+Electronics; ComponentLink8URL: https://datasheet.octopart.com:443/RC0402FR-0722KL-Yageo-datasheet-12531192.pdf?src-supplier=Future+Electronics; ComponentLink8Description: https://datasheet.octopart.com:443/RC0402FR-0722KL-Yageo-datasheet-12531192.pdf?src-supplier=Future+Electronics; ComponentLink9URL: https://datasheet.octopart.com:443/RC0402FR-0722KL-Yageo-datasheet-8324255.pdf?src-supplier=Future+Electronics; ComponentLink9Description: https://datasheet.octopart.com:443/RC0402FR-0722KL-Yageo-datasheet-8324255.pdf?src-supplier=Future+Electronics; ComponentLink10URL: https://datasheet.octopart.com:443/RC0402FR-0722KL-Yageo-datasheet-8329306.pdf?src-supplier=element14; ComponentLink10Description: https://datasheet.octopart.com:443/RC0402FR-0722KL-Yageo-datasheet-8329306.pdf?src-supplier=element14; ComponentLink11URL: https://datasheet.octopart.com:443/RC0402FR-0722KL-Yageo-datasheet-8324527.pdf?src-supplier=Newark; ComponentLink11Description: https://datasheet.octopart.com:443/RC0402FR-0722KL-Yageo-datasheet-8324527.pdf?src-supplier=Newark; ComponentLink12URL: https://datasheet.octopart.com:443/RC0402FR-0722KL-Yageo-Group-datasheet-189192902.pdf?src-supplier=LCSC; ComponentLink12Description: https://datasheet.octopart.com:443/RC0402FR-0722KL-Yageo-Group-datasheet-189192902.pdf?src-supplier=LCSC; ComponentLink13URL: https://datasheet.octopart.com:443/RC0402FR-0722KL-Yageo-datasheet-175423674.pdf?src-supplier=SOS+electronic; ComponentLink13Description: https://datasheet.octopart.com:443/RC0402FR-0722KL-Yageo-datasheet-175423674.pdf?src-supplier=SOS+electronic; ComponentLink14URL: https://datasheet.octopart.com:443/RC0402FR-0722KL-Yageo-datasheet-148775077.pdf?src-supplier=TME; ComponentLink14Description: https://datasheet.octopart.com:443/RC0402FR-0722KL-Yageo-datasheet-148775077.pdf?src-supplier=TME; ComponentLink15URL: https://datasheet.octopart.com:443/RC0402FR-0722KL-Yageo-datasheet-79472498.pdf?src-supplier=Megastar; ComponentLink15Description: https://datasheet.octopart.com:443/RC0402FR-0722KL-Yageo-datasheet-79472498.pdf?src-supplier=Megastar; ComponentLink16URL: https://datasheet.octopart.com/RC0402FR-0722KL-Yageo-datasheet-73766026.pdf; ComponentLink16Description: https://datasheet.octopart.com/RC0402FR-0722KL-Yageo-datasheet-73766026.pdf; ComponentLink17URL: http://sigma.octopart.com:80/conflict_mineral_statement/Yageo-company-3.pdf?src-supplier=Compliance+Statements; ComponentLink17Description: http://sigma.octopart.com:80/conflict_mineral_statement/Yageo-company-3.pdf?src-supplier=Compliance+Statements; ComponentLink18URL: http://sigma.octopart.com:80/rohs_statement/Yageo-company-2.pdf?src-supplier=Compliance+Statements; ComponentLink18Description: http://sigma.octopart.com:80/rohs_statement/Yageo-company-2.pdf?src-supplier=Compliance+Statements; Supplier 2: LCSC; Supplier Part Number 2: C82868
U19 U21 = SKY13330-397LF: RF Switch SP2T 100MHz to 6GHz 16dB Automotive 12-Pin QFN EP; Manufacturer: Skyworks Solutions; Throw Configuration: SPDT; P1dB: 39dBm; Impedance: 50R; Insertion Loss: 0.65dB; Turn-Off Delay Time: 1.6us; Supplier 1: Mouser; Supplier Part Number 1: 873-SKY13330-397LF; Manufacturer Part Number: SKY13330-397LF; RoHS: Yes; Category: RF Semiconductors and Devices; Pricing 1: 1=1.02000, 10=0.86600, 50=0.86600, 100=0.66600, 500=0.58800, 1000=0.46500, 3000=0.43000, 10000=0.43000 (USD); Mount: Surface Mount; Case/Package: QFN; Number of Pins: 12; Contact Plating: Tin,Matte; Weight: 0.000776oz; Min Operating Temperature: -40°C; Max Operating Temperature: 85°C; Frequency: 100MHz; Packaging: Tape and Reel; Package Quantity: 3000; Turn-On Delay Time: 1.6us; Max Frequency: 6GHz; Radiation Hardening: No; ComponentLink1URL: https://datasheet.ciiva.com/15100/getdatasheetpartid-656010-15100460.pdf?src-supplier=Verical; ComponentLink1Description: https://datasheet.ciiva.com/15100/getdatasheetpartid-656010-15100460.pdf?src-supplier=Verical; Supplier 2: Digi-Key; Supplier Part Number 2: 863-1643-2-ND; Supplier 3: Arrow Electronics; Supplier Part Number 3: SKY13330-397LF
U20 = PGA-103+: LNA NF=0.6dB ML AMPL / SURF MT / 4GHZ RoHS; Manufacturer: Mini-Circuits; Supplier 1: Mouser; Supplier Part Number 1: 139-PGA-103; Manufacturer Part Number: PGA-103+; Category: RF Amplifiers; Stock 1: 449; Pricing 1: 1=3.67000, 10=3.28000, 50=3.28000, 100=2.69000, 1000=1.83000, 10000=1.74000 (USD); RoHS Compliant: Yes; ComponentLink1URL: https://datasheet.octopart.com/PGA-103%2B-Mini-Circuits-datasheet-79796973.pdf?src-supplier=Component+Distributors+Inc.; ComponentLink1Description: https://datasheet.octopart.com/PGA-103%2B-Mini-Circuits-datasheet-79796973.pdf?src-supplier=Component+Distributors+Inc.; Supplier 2: Digi-Key; Supplier Part Number 2: 3157-PGA-103+CT-ND